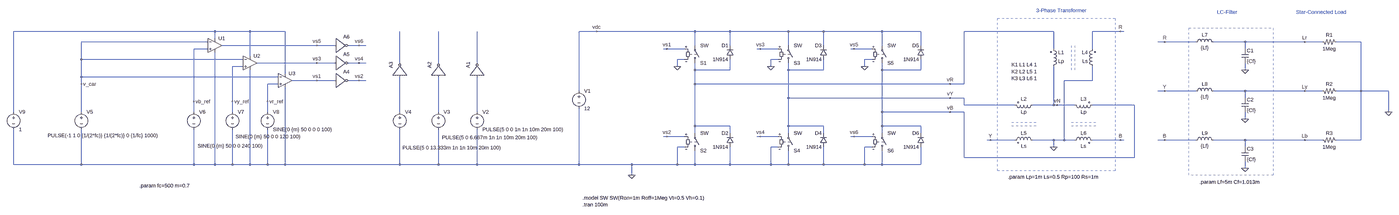
[diagram p0: schematic three-phase-inverter_v1p0.asc, whole sheet]
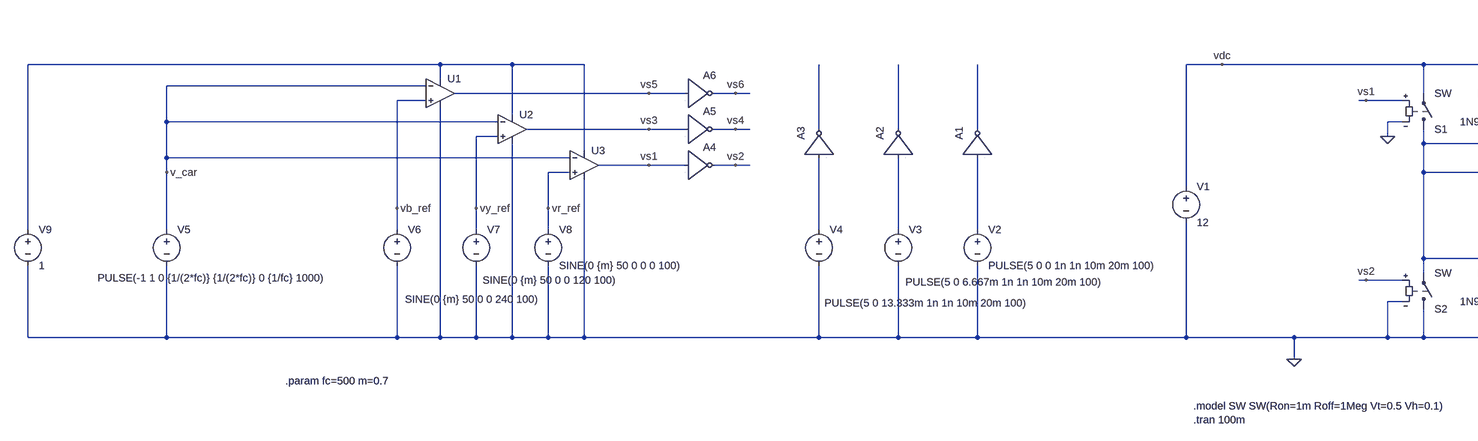
[diagram p1: schematic three-phase-inverter_v1p0.asc, part, row 1 of 1, column 1 of 2]
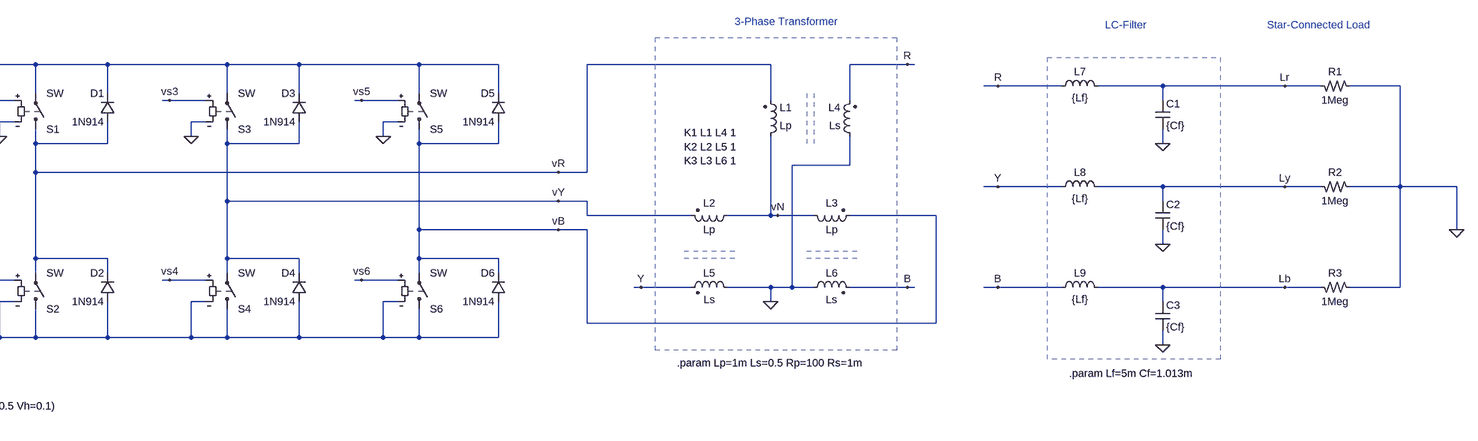
[diagram p2: schematic three-phase-inverter_v1p0.asc, part, row 1 of 1, column 2 of 2]
three-phase-inverter_v1p0.asc, the LTspice schematic file:
Version 4
SHEET 1 3732 868
WIRE -2176 64 -3136 64
WIRE -2016 64 -2176 64
WIRE -1856 64 -2016 64
WIRE -208 64 -288 64
WIRE 240 64 -208 64
WIRE 400 64 240 64
WIRE 704 64 400 64
WIRE 864 64 704 64
WIRE 1136 64 864 64
WIRE 1312 64 1136 64
WIRE 2032 64 1536 64
WIRE 2336 64 2208 64
WIRE 2352 64 2336 64
WIRE -2176 96 -2176 64
WIRE -2208 112 -2784 112
WIRE 2544 112 2512 112
WIRE 2688 112 2544 112
WIRE 2912 112 2768 112
WIRE 3232 112 2912 112
WIRE 3312 112 3232 112
WIRE 3488 112 3376 112
WIRE -1712 128 -2144 128
WIRE -1632 128 -1712 128
WIRE -1520 128 -1568 128
WIRE -1488 128 -1520 128
WIRE 240 128 240 64
WIRE 400 128 400 64
WIRE 704 128 704 64
WIRE 864 128 864 64
WIRE 1136 128 1136 64
WIRE 1312 128 1312 64
WIRE -2208 144 -2272 144
WIRE 112 144 96 144
WIRE 192 144 112 144
WIRE 576 144 560 144
WIRE 656 144 576 144
WIRE 1008 144 992 144
WIRE 1088 144 1008 144
WIRE 2032 144 2032 64
WIRE 2208 144 2208 64
WIRE 2912 144 2912 112
WIRE -2016 176 -2016 64
WIRE -2784 192 -2784 112
WIRE -2048 192 -2784 192
WIRE 192 192 160 192
WIRE 656 192 624 192
WIRE 1088 192 1056 192
WIRE -1712 208 -1984 208
WIRE -1632 208 -1712 208
WIRE -1520 208 -1568 208
WIRE -1488 208 -1520 208
WIRE -1104 208 -1104 64
WIRE -928 208 -928 64
WIRE -752 208 -752 64
WIRE -2048 224 -2096 224
WIRE 160 224 160 192
WIRE 624 224 624 192
WIRE 1056 224 1056 192
WIRE 240 240 240 208
WIRE 400 240 400 192
WIRE 400 240 240 240
WIRE 704 240 704 208
WIRE 864 240 864 192
WIRE 864 240 704 240
WIRE 1136 240 1136 208
WIRE 1312 240 1312 192
WIRE 1312 240 1136 240
WIRE 2912 240 2912 208
WIRE -1856 256 -1856 64
WIRE -2784 272 -2784 192
WIRE -1888 272 -2784 272
WIRE -1712 288 -1824 288
WIRE -1632 288 -1712 288
WIRE -1520 288 -1568 288
WIRE -1488 288 -1520 288
WIRE 2208 288 2208 224
WIRE 2208 288 2080 288
WIRE -2784 304 -2784 272
WIRE -1888 304 -1936 304
WIRE 240 304 240 240
WIRE 1472 304 240 304
WIRE 1536 304 1536 64
WIRE 1536 304 1472 304
WIRE -288 336 -288 64
WIRE 2544 336 2512 336
WIRE 2688 336 2544 336
WIRE 2912 336 2768 336
WIRE 3232 336 2912 336
WIRE 3312 336 3232 336
WIRE 3488 336 3488 112
WIRE 3488 336 3376 336
WIRE 3712 336 3488 336
WIRE 704 368 704 240
WIRE 1472 368 704 368
WIRE 1536 368 1472 368
WIRE 2912 368 2912 336
WIRE -2272 384 -2272 144
WIRE -2096 384 -2096 224
WIRE -1936 384 -1936 304
WIRE 1536 400 1536 368
WIRE 1856 400 1536 400
WIRE 2032 400 2032 224
WIRE 2032 400 1936 400
WIRE 2048 400 2032 400
WIRE 2128 400 2048 400
WIRE 2400 400 2208 400
WIRE -3136 432 -3136 64
WIRE -2784 432 -2784 304
WIRE -2272 432 -2272 384
WIRE -2096 432 -2096 384
WIRE -1936 432 -1936 384
WIRE -1104 432 -1104 272
WIRE -928 432 -928 272
WIRE -752 432 -752 272
WIRE 1136 432 1136 240
WIRE 1472 432 1136 432
WIRE 1536 432 1472 432
WIRE 3712 432 3712 336
WIRE 2912 464 2912 432
WIRE 240 496 240 304
WIRE 400 496 240 496
WIRE 704 496 704 368
WIRE 864 496 704 496
WIRE 1136 496 1136 432
WIRE 1312 496 1136 496
WIRE 240 528 240 496
WIRE 400 528 400 496
WIRE 704 528 704 496
WIRE 864 528 864 496
WIRE 1136 528 1136 496
WIRE 1312 528 1312 496
WIRE 112 544 96 544
WIRE 192 544 112 544
WIRE 576 544 560 544
WIRE 656 544 576 544
WIRE 1008 544 992 544
WIRE 1088 544 1008 544
WIRE 1744 560 1728 560
WIRE 1856 560 1744 560
WIRE 2032 560 1936 560
WIRE 2080 560 2080 288
WIRE 2080 560 2032 560
WIRE 2128 560 2080 560
WIRE 2336 560 2208 560
WIRE 2352 560 2336 560
WIRE 2544 560 2512 560
WIRE 2688 560 2544 560
WIRE 2912 560 2768 560
WIRE 3232 560 2912 560
WIRE 3312 560 3232 560
WIRE 3488 560 3488 336
WIRE 3488 560 3376 560
WIRE 192 592 160 592
WIRE 656 592 624 592
WIRE 1088 592 1056 592
WIRE 2032 592 2032 560
WIRE 2912 592 2912 560
WIRE 1536 640 1536 432
WIRE 2400 640 2400 400
WIRE 2400 640 1536 640
WIRE -3136 672 -3136 512
WIRE -2784 672 -2784 512
WIRE -2784 672 -3136 672
WIRE -2272 672 -2272 512
WIRE -2272 672 -2784 672
WIRE -2176 672 -2176 160
WIRE -2176 672 -2272 672
WIRE -2096 672 -2096 512
WIRE -2096 672 -2176 672
WIRE -2016 672 -2016 240
WIRE -2016 672 -2096 672
WIRE -1936 672 -1936 512
WIRE -1936 672 -2016 672
WIRE -1856 672 -1856 320
WIRE -1856 672 -1936 672
WIRE -1104 672 -1104 512
WIRE -1104 672 -1856 672
WIRE -928 672 -928 512
WIRE -928 672 -1104 672
WIRE -752 672 -752 512
WIRE -752 672 -928 672
WIRE -288 672 -288 416
WIRE -288 672 -752 672
WIRE -48 672 -288 672
WIRE 160 672 160 592
WIRE 160 672 -48 672
WIRE 240 672 240 608
WIRE 240 672 160 672
WIRE 400 672 400 592
WIRE 400 672 240 672
WIRE 624 672 624 592
WIRE 624 672 400 672
WIRE 704 672 704 608
WIRE 704 672 624 672
WIRE 864 672 864 592
WIRE 864 672 704 672
WIRE 1056 672 1056 592
WIRE 1056 672 864 672
WIRE 1136 672 1136 608
WIRE 1136 672 1056 672
WIRE 1312 672 1312 592
WIRE 1312 672 1136 672
WIRE 2912 688 2912 656
WIRE -48 720 -48 672
FLAG 160 224 0
FLAG 624 224 0
FLAG 1056 224 0
FLAG -208 64 vdc
FLAG 112 144 vs1
FLAG 112 544 vs2
FLAG 576 144 vs3
FLAG 576 544 vs4
FLAG 1008 144 vs5
FLAG 1008 544 vs6
FLAG 1472 304 vR
FLAG 1472 368 vY
FLAG 1472 432 vB
FLAG -48 720 0
FLAG 2048 400 vN
FLAG 1744 560 Y
FLAG 2336 64 R
FLAG 2336 560 B
FLAG 3712 432 0
FLAG 2544 112 R
FLAG 2544 336 Y
FLAG 2544 560 B
FLAG 2032 592 0
FLAG -2784 304 v_car
FLAG -1712 288 vs1
FLAG -1712 208 vs3
FLAG -1712 128 vs5
FLAG -1936 384 vr_ref
FLAG -2272 384 vb_ref
FLAG -2096 384 vy_ref
FLAG -1520 288 vs2
FLAG -1520 208 vs4
FLAG -1520 128 vs6
FLAG 3232 112 Lr
FLAG 3232 336 Ly
FLAG 3232 560 Lb
FLAG 2912 240 0
FLAG 2912 464 0
FLAG 2912 688 0
SYMBOL sw 240 224 M180
SYMATTR InstName S1
SYMBOL sw 240 624 M180
SYMATTR InstName S2
SYMBOL sw 704 224 M180
SYMATTR InstName S3
SYMBOL sw 704 624 M180
SYMATTR InstName S4
SYMBOL sw 1136 224 M180
SYMATTR InstName S5
SYMBOL sw 1136 624 M180
SYMATTR InstName S6
SYMBOL voltage -288 320 R0
SYMATTR InstName V1
SYMATTR Value 12
SYMBOL voltage -752 416 R0
SYMATTR InstName V2
SYMATTR Value PULSE(5 0 0 1n 1n 10m 20m 100)
SYMBOL voltage -928 416 R0
WINDOW 3 16 132 Left 2
SYMATTR Value PULSE(5 0 6.667m 1n 1n 10m 20m 100)
SYMATTR InstName V3
SYMBOL voltage -1104 416 R0
WINDOW 3 12 179 Left 2
SYMATTR Value PULSE(5 0 13.333m 1n 1n 10m 20m 100)
SYMATTR InstName V4
SYMBOL diode 416 192 R180
WINDOW 0 24 64 Left 2
WINDOW 3 24 0 Left 2
SYMATTR InstName D1
SYMATTR Value 1N914
SYMBOL diode 416 592 R180
WINDOW 0 24 64 Left 2
WINDOW 3 24 0 Left 2
SYMATTR InstName D2
SYMATTR Value 1N914
SYMBOL diode 880 192 R180
WINDOW 0 24 64 Left 2
WINDOW 3 24 0 Left 2
SYMATTR InstName D3
SYMATTR Value 1N914
SYMBOL diode 880 592 R180
WINDOW 0 24 64 Left 2
WINDOW 3 24 0 Left 2
SYMATTR InstName D4
SYMATTR Value 1N914
SYMBOL diode 1328 192 R180
WINDOW 0 24 64 Left 2
WINDOW 3 24 0 Left 2
SYMATTR InstName D5
SYMATTR Value 1N914
SYMBOL diode 1328 592 R180
WINDOW 0 24 64 Left 2
WINDOW 3 24 0 Left 2
SYMATTR InstName D6
SYMATTR Value 1N914
SYMBOL Digital/inv -816 272 R270
SYMATTR InstName A1
SYMBOL Digital/inv -992 272 R270
SYMATTR InstName A2
SYMBOL Digital/inv -1168 272 R270
SYMATTR InstName A3
SYMATTR SpiceLine VHIGH=5
SYMBOL ind2 2016 240 M180
WINDOW 0 36 80 Left 2
WINDOW 3 36 40 Left 2
SYMATTR InstName L1
SYMATTR Value Lp
SYMATTR SpiceLine Rser=Rp
SYMBOL ind2 1952 384 R90
WINDOW 0 4 56 VBottom 2
WINDOW 3 32 56 VTop 2
SYMATTR InstName L2
SYMATTR Value Lp
SYMATTR SpiceLine Rser=Rp
SYMBOL ind2 2112 384 M90
WINDOW 0 4 56 VBottom 2
WINDOW 3 32 56 VTop 2
SYMATTR InstName L3
SYMATTR Value Lp
SYMATTR SpiceLine Rser=Rp
SYMBOL ind2 2224 240 R180
WINDOW 0 36 80 Left 2
WINDOW 3 36 40 Left 2
SYMATTR InstName L4
SYMATTR Value Ls
SYMATTR SpiceLine Rser=Rs
SYMBOL ind2 1952 576 M270
WINDOW 0 32 56 VTop 2
WINDOW 3 4 56 VBottom 2
SYMATTR InstName L5
SYMATTR Value Ls
SYMATTR SpiceLine Rser=Rs
SYMBOL ind2 2112 576 R270
WINDOW 0 32 56 VTop 2
WINDOW 3 4 56 VBottom 2
SYMATTR InstName L6
SYMATTR Value Ls
SYMATTR SpiceLine Rser=Rs
SYMBOL res2 3312 96 M90
WINDOW 0 0 32 VBottom 2
WINDOW 3 32 32 VTop 2
SYMATTR InstName R1
SYMATTR Value 1Meg
SYMBOL res2 3312 320 M90
WINDOW 0 0 32 VBottom 2
WINDOW 3 32 32 VTop 2
SYMATTR InstName R2
SYMATTR Value 1Meg
SYMBOL res2 3312 544 M90
WINDOW 0 0 32 VBottom 2
WINDOW 3 32 32 VTop 2
SYMATTR InstName R3
SYMATTR Value 1Meg
SYMBOL voltage -2784 416 R0
WINDOW 3 -154 123 Left 2
WINDOW 123 0 0 Left 0
WINDOW 39 0 0 Left 0
SYMATTR InstName V5
SYMATTR Value PULSE(-1 1 0 {1/(2*fc)} {1/(2*fc)} 0 {1/fc} 1000)
SYMBOL voltage -2272 416 R0
WINDOW 3 18 171 Left 2
WINDOW 123 0 0 Left 0
WINDOW 39 0 0 Left 0
SYMATTR InstName V6
SYMATTR Value SINE(0 {m} 50 0 0 240 100)
SYMBOL voltage -2096 416 R0
WINDOW 3 14 128 Left 2
WINDOW 123 0 0 Left 0
WINDOW 39 0 0 Left 0
SYMATTR InstName V7
SYMATTR Value SINE(0 {m} 50 0 0 120 100)
SYMBOL voltage -1936 416 R0
WINDOW 123 0 0 Left 0
WINDOW 39 0 0 Left 0
SYMATTR InstName V8
SYMATTR Value SINE(0 {m} 50 0 0 0 100)
SYMBOL OpAmps\\UniversalOpAmp2 -2176 128 R0
SYMATTR InstName U1
SYMBOL OpAmps\\UniversalOpAmp2 -2016 208 R0
SYMATTR InstName U2
SYMBOL OpAmps\\UniversalOpAmp2 -1856 288 R0
SYMATTR InstName U3
SYMBOL voltage -3136 416 R0
WINDOW 123 0 0 Left 0
WINDOW 39 0 0 Left 0
SYMATTR InstName V9
SYMATTR Value 1
SYMBOL Digital/inv -1632 224 R0
SYMATTR InstName A4
SYMBOL Digital/inv -1632 144 R0
SYMATTR InstName A5
SYMBOL Digital/inv -1632 64 R0
SYMATTR InstName A6
SYMBOL ind 2672 128 R270
WINDOW 0 32 56 VTop 2
WINDOW 3 5 56 VBottom 2
SYMATTR InstName L7
SYMATTR Value {Lf}
SYMATTR SpiceLine Rser=1m
SYMBOL ind 2672 352 R270
WINDOW 0 32 56 VTop 2
WINDOW 3 5 56 VBottom 2
SYMATTR InstName L8
SYMATTR Value {Lf}
SYMATTR SpiceLine Rser=1m
SYMBOL ind 2672 576 R270
WINDOW 0 32 56 VTop 2
WINDOW 3 5 56 VBottom 2
SYMATTR InstName L9
SYMATTR Value {Lf}
SYMATTR SpiceLine Rser=1m
SYMBOL cap 2896 144 R0
SYMATTR InstName C1
SYMATTR Value {Cf}
SYMBOL cap 2896 368 R0
SYMATTR InstName C2
SYMATTR Value {Cf}
SYMBOL cap 2896 592 R0
SYMATTR InstName C3
SYMATTR Value {Cf}
TEXT -272 824 Left 2 !.model SW SW(Ron=1m Roff=1Meg Vt=0.5 Vh=0.1)\n.tran 100m
TEXT 1840 216 Left 2 !K1 L1 L4 1\nK2 L2 L5 1\nK3 L3 L6 1
TEXT 1952 -32 Left 2 ;3-Phase Transformer
TEXT 3192 -24 Left 2 ;Star-Connected Load
TEXT -2520 768 Left 2 !.param fc=500 m=0.7
TEXT 2784 -24 Left 2 ;LC-Filter
TEXT 2704 752 Left 2 !.param Lf=5m Cf=1.013m
TEXT 1824 728 Left 2 !.param Lp=1m Ls=0.5 Rp=100 Rs=1m
LINE Normal 2112 128 2112 240 2
LINE Normal 2128 128 2128 240 2
LINE Normal 2224 480 2112 480 2
LINE Normal 2224 496 2112 496 2
LINE Normal 1952 480 1840 480 2
LINE Normal 1952 496 1840 496 2
RECTANGLE Normal 1776 4 2312 700 2
RECTANGLE Normal 3040 720 2656 48 2

The netlist it stands for:
* three-phase-inverter_v1p0.asc
S1 vR vdc vs1 0 SW
S2 0 vR vs2 0 SW
S3 vY vdc vs3 0 SW
S4 0 vY vs4 0 SW
S5 vB vdc vs5 0 SW
S6 0 vB vs6 0 SW
V1 vdc 0 12
V2 N007 0 PULSE(5 0 0 1n 1n 10m 20m 100)
V3 N006 0 PULSE(5 0 6.667m 1n 1n 10m 20m 100)
V4 N005 0 PULSE(5 0 13.333m 1n 1n 10m 20m 100)
D1 vR vdc 1N914
D2 0 vR 1N914
D3 vY vdc 1N914
D4 0 vY 1N914
D5 vB vdc 1N914
D6 0 vB 1N914
A1 N007 0 0 0 0 N004 0 0 BUF
A2 N006 0 0 0 0 N003 0 0 BUF
A3 N005 0 0 0 0 N002 0 0 BUF VHIGH=5
L1 vN vR Lp Rser=Rp
L2 vN vY Lp Rser=Rp
L3 vN vB Lp Rser=Rp
L4 0 R Ls Rser=Rs
L5 0 Y Ls Rser=Rs
L6 0 B Ls Rser=Rs
R1 Lr 0 1Meg
R2 Ly 0 1Meg
R3 Lb 0 1Meg
V5 v_car 0 PULSE(-1 1 0 {1/(2*fc)} {1/(2*fc)} 0 {1/fc} 1000)
V6 vb_ref 0 SINE(0 {m} 50 0 0 240 100)
V7 vy_ref 0 SINE(0 {m} 50 0 0 120 100)
V8 vr_ref 0 SINE(0 {m} 50 0 0 0 100)
XU1 vb_ref v_car N001 0 vs5 level2 Avol=1Meg GBW=10Meg Slew=10Meg Ilimit=25m Rail=0 Vos=0 En=0 Enk=0 In=0 Ink=0 Rin=500Meg  ; pins In+ In- V+ V- OUT
XU2 vy_ref v_car N001 0 vs3 level2 Avol=1Meg GBW=10Meg Slew=10Meg Ilimit=25m Rail=0 Vos=0 En=0 Enk=0 In=0 Ink=0 Rin=500Meg  ; pins In+ In- V+ V- OUT
XU3 vr_ref v_car N001 0 vs1 level2 Avol=1Meg GBW=10Meg Slew=10Meg Ilimit=25m Rail=0 Vos=0 En=0 Enk=0 In=0 Ink=0 Rin=500Meg  ; pins In+ In- V+ V- OUT
V9 N001 0 1
A4 vs1 0 0 0 0 vs2 0 0 BUF
A5 vs3 0 0 0 0 vs4 0 0 BUF
A6 vs5 0 0 0 0 vs6 0 0 BUF
L7 R Lr {Lf} Rser=1m
L8 Y Ly {Lf} Rser=1m
L9 B Lb {Lf} Rser=1m
C1 Lr 0 {Cf}
C2 Ly 0 {Cf}
C3 Lb 0 {Cf}
.model D D
.lib standard.dio
.model SW SW(Ron=1m Roff=1Meg Vt=0.5 Vh=0.1)
.tran 100m
K1 L1 L4 1
K2 L2 L5 1
K3 L3 L6 1
* 3-Phase Transformer
* Star-Connected Load
.param fc=500 m=0.7
* LC-Filter
.param Lf=5m Cf=1.013m
.param Lp=1m Ls=0.5 Rp=100 Rs=1m
.lib UniversalOpAmp2.lib
.backanno
.end